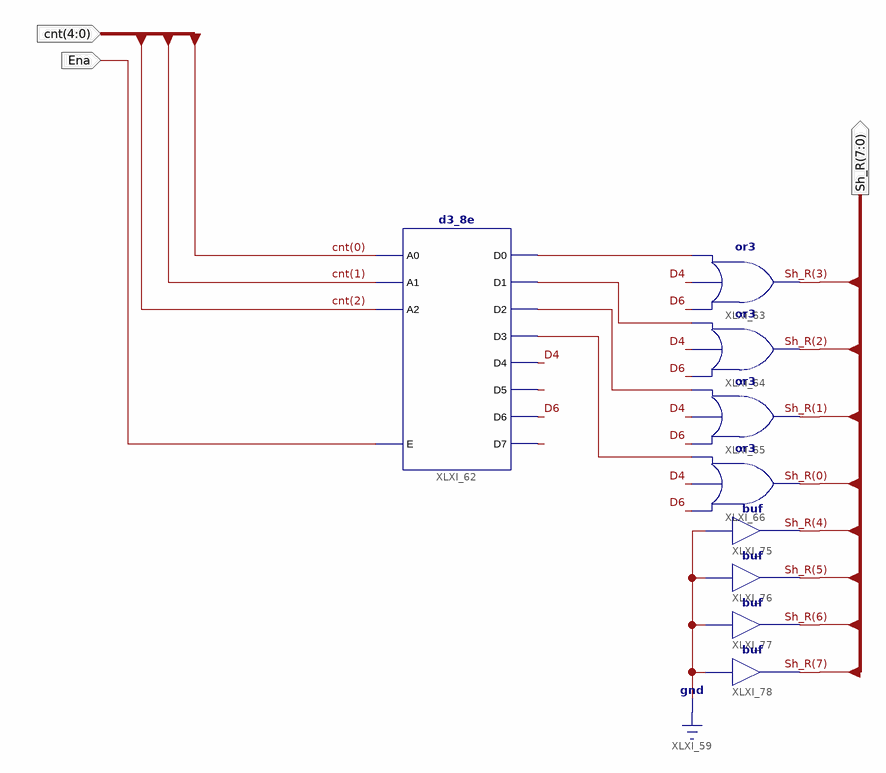
[diagram p0: schematic sheet 1]
// Xilinx ISE schematic Sh_RM.sch (spartan6) as structural Verilog: 9 symbols, 3 ports
module Sh_RM (
  input  [4:0] cnt,
  input  Ena,
  output [7:0] Sh_R
);

  wire D4, D6, XLXN_115, XLXN_117, XLXN_118, XLXN_119, XLXN_125, XLXN_127;

  d3_8e XLXI_62 (
    .A0(cnt[0]), .A1(cnt[1]), .A2(cnt[2]), .E(Ena), .D0(XLXN_115), .D1(XLXN_119), .D2(XLXN_117),
    .D3(XLXN_118), .D4(D4), .D5(XLXN_125), .D6(D6), .D7(XLXN_127));
  or XLXI_63 (Sh_R[3], D6, D4, XLXN_115);
  or XLXI_64 (Sh_R[2], D6, D4, XLXN_119);
  or XLXI_65 (Sh_R[1], D6, D4, XLXN_117);
  or XLXI_66 (Sh_R[0], D6, D4, XLXN_118);
  buf XLXI_75 (Sh_R[4], 1'b0);
  buf XLXI_76 (Sh_R[5], 1'b0);
  buf XLXI_77 (Sh_R[6], 1'b0);
  buf XLXI_78 (Sh_R[7], 1'b0);
endmodule
